# Altium schematic sheet RS232.SchDoc
size A4
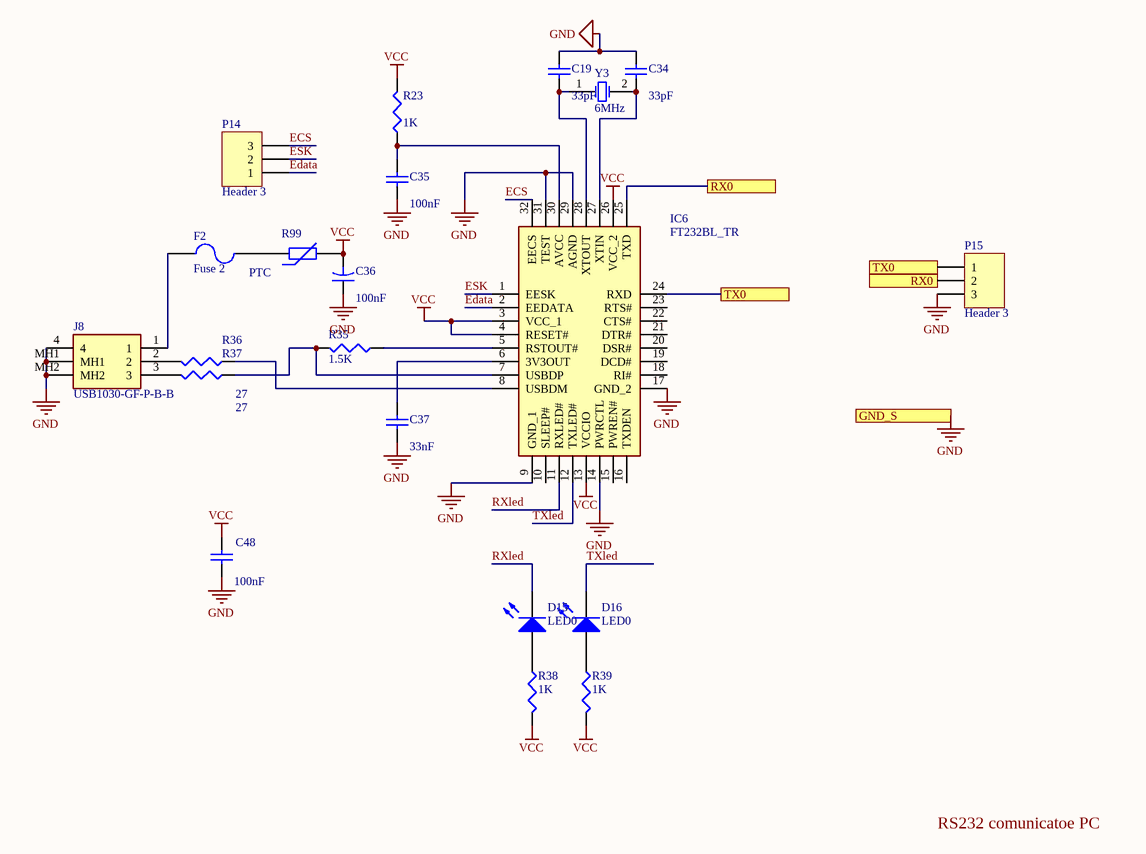
[diagram p0: RS232.SchDoc]

## Parts
C19  value 33pF  [1206 CAP]  (hidden comment: 1206CAP 33pF)
C34  value 33pF  [1206 CAP]  (hidden comment: 1206CAP 33pF)
C35  value 100nF  [1206 CAP]  (hidden comment: 1206CAP 100nF)
C36  value 100nF  [TH polarized 5mm]  (hidden comment: polarized cap 5mm pitch)
C37  value 33nF  [1206 CAP]  (hidden comment: 1206CAP 33nF)
C48  value 100nF  [1206 CAP]  (hidden comment: 1206CAP 100nF)
D15  LED0  [6-0805_L]
D16  LED0  [6-0805_L]
F2  Fuse 2  [THROUGH HOLE 5mm]
IC6  FT232BL_TR  [QFP80P900X900X160-32N]
J8  USB1030-GF-P-B-B  [USB1030GFPBB]
P14  Header 3  [HDR1X3]
P15  Header 3  [HDR1X3]
R23  value 1K  [0805]  (hidden comment: 0805RES 1K)
R35  value 1.5K  [1206 CAP]  (hidden comment: 1206RES 1K5)
R36  value 27  [1206 CAP]  (hidden comment: 1206RES 27 OHM)
R37  value 27  [1206 CAP]  (hidden comment: 1206RES 27 OHM)
R38  value 1K  [J1-0603]  (hidden comment: 0603RES 1K)
R39  value 1K  [J1-0603]  (hidden comment: 0603RES 1K)
R99  PTC  [R38]
Y3  6MHz  [RAD-0.2]

## Ports
GND_S, RX0, TX0

## Nets
GND: C19.1 C34.1 C35.1 C36.1 C37.1 C48.1 IC6.9(GND_1) IC6.14(PWRCTL) IC6.17(GND_2) IC6.29(AGND) IC6.31(TEST) J8.4 J8.MH1 J8.MH2 P15.3 ; port GND_S
VCC: C36.2 C48.2 IC6.3(VCC_1) IC6.4(RESET#) IC6.13(VCCIO) IC6.26(VCC_2) R23.2 R38.2 R39.2 R99.2
ECS: IC6.32(EECS) P14.3
Edata: IC6.2(EEDATA) P14.1
ESK: IC6.1(EESK) P14.2
RX0: IC6.25(TXD) P15.2 ; port RX0
RXled: D15.2(K) IC6.11(RXLED#)
TX0: IC6.24(RXD) P15.1 ; port TX0
TXled: D16.2(K) IC6.12(TXLED#)
NetC19_2: C19.2 IC6.28(XTOUT) Y3.1(OSC1)
NetC34_2: C34.2 IC6.27(XTIN) Y3.2(OSC2)
NetC35_2: C35.2 IC6.30(AVCC) R23.1
NetC37_2: C37.2 IC6.6(3V3OUT)
NetD15_1: D15.1(A) R38.1
NetD16_1: D16.1(A) R39.1
NetF2_1: F2.1 J8.1
NetF2_2: F2.2 R99.1
NetIC6_5: IC6.5(RSTOUT#) R35.1
NetIC6_7: IC6.7(USBDP) R35.2 R37.1
NetIC6_8: IC6.8(USBDM) R36.1
NetJ8_2: J8.2 R36.2
NetJ8_3: J8.3 R37.2

Not connected (* = marked no-connect by the designer): IC6 10(SLEEP#) 15(PWREN#) 16(TXDEN) 18(RI#) 19(DCD#) 20(DSR#) 21(DTR#) 22(CTS#) 23(RTS#)

## Notes on the sheet
- RS232 comunicatoe PC

## Library data of the parts
C19 C34 C35 C37 C48 = Cap Semi: Published: 8-Jun-2000; LatestRevisionDate: 29-May-2009; LatestRevisionNote: IPC-7351 Footprint Added.; PackageReference: C1206; Publisher: Altium Limited; PackageDescription: Chip Capacitor
C36 = Cap2: Published: 23-Sep-2002; PackageReference: CAPR5-4X5; Publisher: Altium Limited; PackageDescription: Capacitor; 2 Leads
D15 D16 = LED0: Typical INFRARED GaAs LED; Published: 8-Jun-2000; LatestRevisionDate: 08-Jul-2005; LatestRevisionNote: Mech Layer 1 removed.; PackageReference: LED-0; Publisher: Altium Limited; PackageDescription: LED; 2 Leads
F2 = Fuse 2: Fuse; Published: 8-Jun-2000; LatestRevisionDate: 17-Jul-2002; LatestRevisionNote: Re-released for DXP Platform.; PackageReference: PIN-W2/E2.8; Publisher: Altium Limited; PackageDescription: Thru-Hole; 2 Leads
IC6 = FT232BL_TR: Integrated Circuit; Manufacturer_Name: FTDI Chip; Manufacturer_Part_Number: FT232BL/TR; Datasheet Link: http://www.ftdichip.com/Support/Documents/DataSheets/ICs/DS_FT232BL_BQ.pdf; Height: 1.6mm
J8 = USB1030-GF-P-B-B: Connector; Manufacturer_Name: GCT (GLOBAL CONNECTOR TECHNOLOGY); Datasheet Link: https://gct.co/files/drawings/usb1030.pdf?v=6f3e53a4-19ab-41a0-8ac3-960e4d6fce65; Height: 11.2mm; Manufacturer_Part_Number: USB1030-GF-P-B-B; Mouser Part Number: 640-USB1030-GF-P-B-B; Mouser Price/Stock: https://www.mouser.co.uk/ProductDetail/GCT/USB1030-GF-P-B-B?qs=KUoIvG%2F9Ila4yhPpaOZhHA%3D%3D
P14 P15 = Header 3: Header, 3-Pin; LatestRevisionDate: 17-Jul-2002; LatestRevisionNote: Re-released for DXP Platform.; Publisher: Altium Limited
R23 R35-R39 = Res3: Published: 8-Jun-2000; LatestRevisionDate: 29-May-2009; LatestRevisionNote: IPC-7351 Footprint Added.; PackageReference: J1-0603; Publisher: Altium Limited; PackageDescription: Chip Resistor
R99 = Res Varistor: Varistor (Voltage-Sensitive Resistor); Published: 24-Mar-1999; LatestRevisionDate: 29-May-2009; LatestRevisionNote: IPC-7351 Footprint Added.; PackageVersion: Mar-2003; PackageReference: 6-0805; Publisher: Altium Limited; PackageDescription: Chip Resistor 0805 Case Size; Code_IPC: RESC2012
Y3 = XTAL: Crystal Oscillator; Published: 8-Jun-2000; LatestRevisionDate: 17-Jul-2002; LatestRevisionNote: Re-released for DXP Platform.; PackageReference: R38; Publisher: Altium Limited; PackageDescription: Crystal, Thru-Hole; 2 Leads; Body 3.1 x 8.2 mm (Dia.xH)